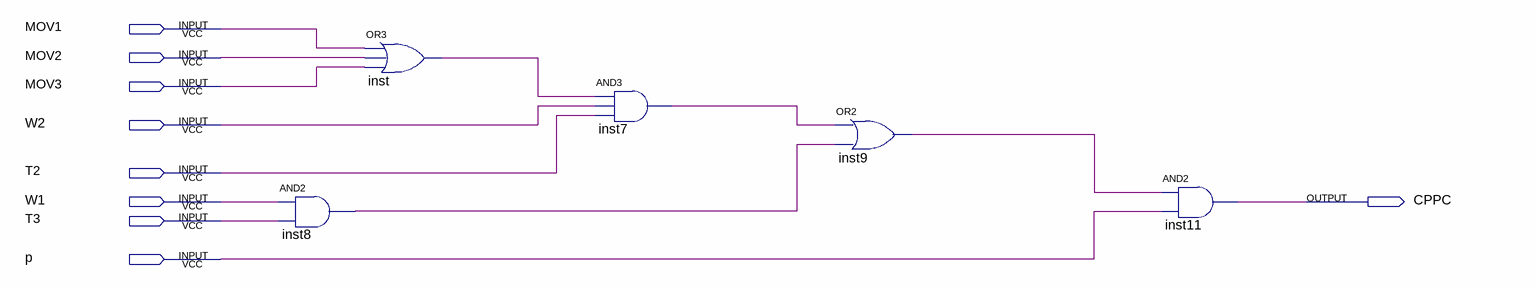
[diagram p0: schematic sheet]
// Quartus schematic CPPC.bdf as structural Verilog: 5 symbols, 9 pins
module CPPC (
  input  MOV1,
  input  MOV2,
  input  MOV3,
  input  W2,
  input  T2,
  input  W1,
  input  T3,
  input  p,
  output CPPC
);

  wire inst7_out, inst8_out, inst9_out, inst_out;

  and inst8 (inst8_out, W1, T3);
  or inst (inst_out, MOV1, MOV2, MOV3);
  and inst7 (inst7_out, inst_out, W2, T2);
  or inst9 (inst9_out, inst7_out, inst8_out);
  and inst11 (CPPC, inst9_out, p);
endmodule
